# Altium project git.PrjPcb
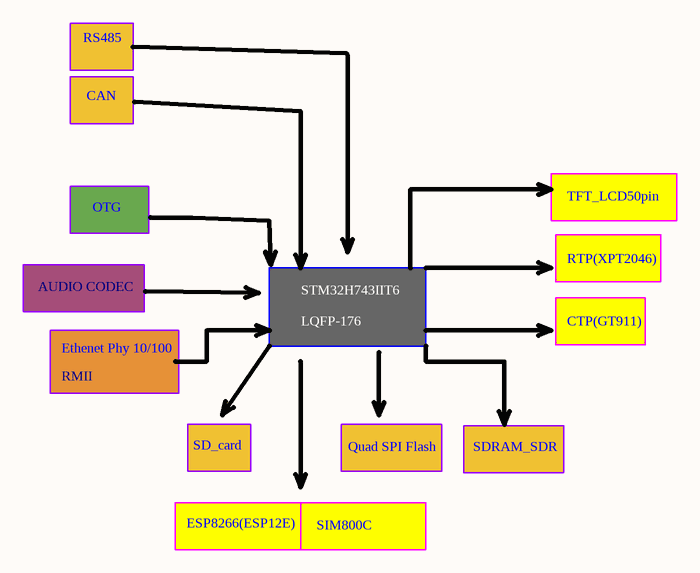
[diagram p0: Block_Diagram.SchDoc]
2 sheets, 15 parts. Net scope: hierarchical (ports join the sheet entries above them; power ports are global).
Board file: MY_HMI.PcbDoc
Sheets:
  Block_Diagram.SchDoc
  TOP.SchDoc

## Sheet Block_Diagram.SchDoc
size A3; SheetNumber: 1; SheetTotal: 22

### Notes on the sheet
- RS485
- CAN
- OTG
- TFT_LCD50pin
- AUDIO CODEC
- STM32H743IIT6
- LQFP-176
- RTP(XPT2046)
- CTP(GT911)
- Ethenet Phy 10/100
- RMII
- SD_card
- Quad SPI Flash
- SDRAM_SDR
- ESP8266(ESP12E)
- SIM800C

## Sheet TOP.SchDoc
size A2; SheetNumber: 3; SheetTotal: 22
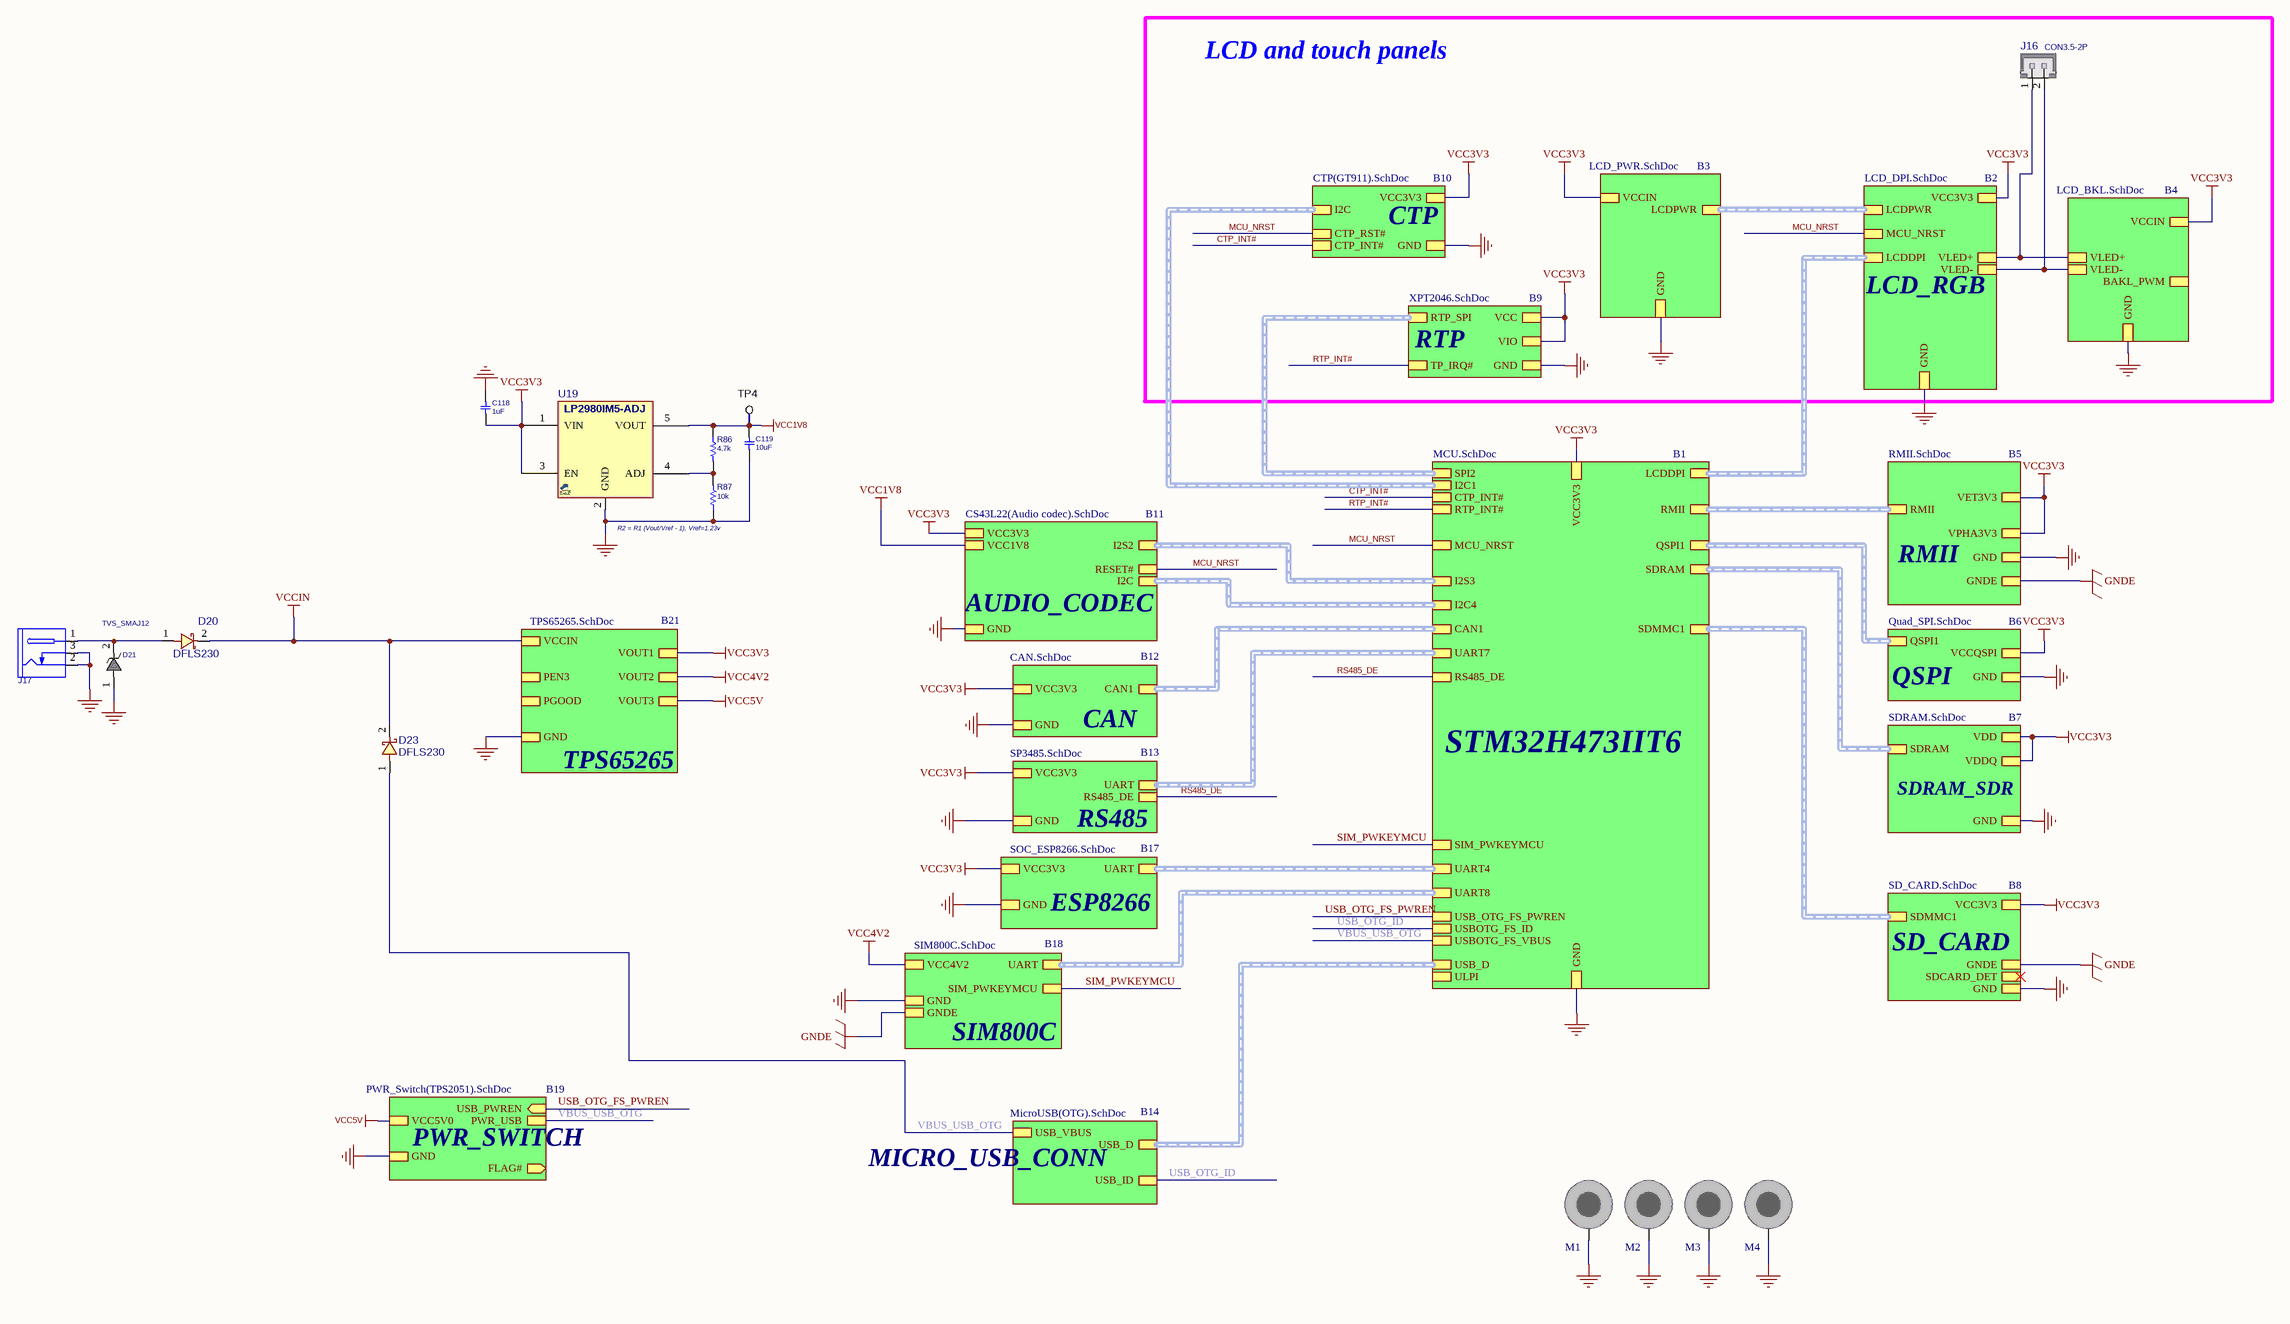
[diagram p1: TOP.SchDoc]

### Parts
C118  1uF  [C0805]
C119  10uF  [C0805]
D20  DFLS230  [D_SOD123W]
D21  TVS_SMAJ12  [D_SMA]
D23  DFLS230  [D_SOD123W]
J16  CON3.5-2P  [ER_CON3P5_2_SMD]
J17  DC_POWER_JACK  [JAC_PWR1]  (value not drawn)
M1  DNP/MH  [SCMH_M3]  (value not drawn)  (no BOM)
M2  DNP/MH  [SCMH_M3]  (value not drawn)  (no BOM)
M3  DNP/MH  [SCMH_M3]  (value not drawn)  (no BOM)
M4  DNP/MH  [SCMH_M3]  (value not drawn)  (no BOM)
R86  4.7k  [R0805]
R87  10k  [R0805]
TP4  TESTPOINT_SMD  [TPSMD_S1]  (value not drawn)  (no BOM)
U19  LP2980IM5-ADJ  [SOT23_5]  (value not drawn)

### Sub-sheets
B1 = MCU.SchDoc (file not in this document): SDRAM (harness SDRAM), LCDDPI (harness LCDDPI), QSPI1 (harness QSPI), RMII (harness RMII), SDMMC1 (harness SDMMC), MCU_NRST, GND, VCC3V3, ULPI (harness ULPI), I2C1 (harness I2C), USB_D (harness USB_D), USBOTG_FS_ID, USBOTG_FS_VBUS, I2C4 (harness I2C), CAN1 (harness CAN), SPI2 (harness SPI), UART4 (harness UART), UART8 (harness UART), UART7 (harness UART), RS485_DE, CTP_INT#, RTP_INT#, I2S3 (harness I2S(Half duplex master)), SIM_PWKEYMCU, USB_OTG_FS_PWREN
B2 = LCD_DPI.SchDoc (file not in this document): LCDDPI (harness LCDDPI), MCU_NRST, GND, VCC3V3, VLED-, VLED+, LCDPWR (harness LCDPWR)
B3 = LCD_PWR.SchDoc (file not in this document): GND, LCDPWR (harness LCDPWR), VCCIN
B4 = LCD_BKL.SchDoc (file not in this document): GND, VCCIN, VLED-, VLED+, BAKL_PWM
B5 = RMII.SchDoc (file not in this document): GND, RMII (harness RMII), GNDE, VET3V3, VPHA3V3
B6 = Quad_SPI.SchDoc (file not in this document): GND, VCCQSPI, QSPI1 (harness QSPI)
B7 = SDRAM.SchDoc (file not in this document): GND, SDRAM (harness SDRAM), VDD, VDDQ
B8 = SD_CARD.SchDoc (file not in this document): GND, VCC3V3, GNDE, SDCARD_DET, SDMMC1 (harness SDMMC)
B9 = XPT2046.SchDoc (file not in this document): GND, VCC, VIO, RTP_SPI (harness SPI), TP_IRQ#
B10 = CTP(GT911).SchDoc (file not in this document): GND, I2C (harness I2C), VCC3V3, CTP_RST#, CTP_INT#
B11 = CS43L22(Audio codec).SchDoc (file not in this document): GND, I2C (harness I2C), VCC3V3, I2S2 (harness I2S(Half duplex master)), VCC1V8, RESET#
B12 = CAN.SchDoc (file not in this document): GND, VCC3V3, CAN1 (harness CAN)
B13 = SP3485.SchDoc (file not in this document): GND, VCC3V3, RS485_DE, UART (harness UART)
B14 = MicroUSB(OTG).SchDoc (file not in this document): USB_D (harness USB_D), USB_ID, USB_VBUS
B17 = SOC_ESP8266.SchDoc (file not in this document): GND, VCC3V3, UART (harness UART)
B18 = SIM800C.SchDoc (file not in this document): GND, UART (harness UART), GNDE, SIM_PWKEYMCU, VCC4V2
B19 = PWR_Switch(TPS2051).SchDoc (file not in this document): GND, VCC5V0, USB_PWREN (in), PWR_USB, FLAG# (out)
B21 = TPS65265.SchDoc (file not in this document): GND, VOUT1, VCCIN, PGOOD, PEN3, VOUT2, VOUT3

### Nets
GND: C118.1 C119.1 D21.1 J17.2(SLEEVE) J17.3(INSERTION_DET) M1.1 M2.1 M3.1 M4.1 R87.1 U19.2(GND) ; sheet B1/GND, sheet B2/GND, sheet B3/GND, sheet B4/GND, sheet B5/GND, sheet B6/GND, sheet B7/GND, sheet B8/GND, sheet B9/GND, sheet B10/GND, sheet B11/GND, sheet B12/GND, sheet B13/GND, sheet B17/GND, sheet B18/GND, sheet B21/GND, sheet B19/GND
GNDE: sheet B5/GNDE, sheet B8/GNDE, sheet B18/GNDE
VCC1V8: C119.2 R86.1 TP4.1 U19.5(VOUT) ; sheet B11/VCC1V8
VCC3V3: C118.2 U19.1(VIN) U19.3(EN) ; sheet B1/VCC3V3, sheet B2/VCC3V3, sheet B3/VCCIN, sheet B4/VCCIN, sheet B5/VET3V3, sheet B5/VPHA3V3, sheet B6/VCCQSPI, sheet B7/VDD, sheet B7/VDDQ, sheet B8/VCC3V3, sheet B9/VCC, sheet B9/VIO, sheet B10/VCC3V3, sheet B11/VCC3V3, sheet B12/VCC3V3, sheet B13/VCC3V3, sheet B17/VCC3V3, sheet B21/VOUT1
VCC4V2: sheet B18/VCC4V2, sheet B21/VOUT2
VCC5V: sheet B21/VOUT3, sheet B19/VCC5V0
VCCIN: D20.2 D23.2 ; sheet B21/VCCIN
CTP_INT#: sheet B1/CTP_INT#, sheet B10/CTP_INT#
MCU_NRST: sheet B1/MCU_NRST, sheet B2/MCU_NRST, sheet B10/CTP_RST#, sheet B11/RESET#
RS485_DE: sheet B1/RS485_DE, sheet B13/RS485_DE
RTP_INT#: sheet B1/RTP_INT#, sheet B9/TP_IRQ#
SIM_PWKEYMCU: sheet B1/SIM_PWKEYMCU, sheet B18/SIM_PWKEYMCU
USB_OTG_FS_PWREN: sheet B1/USB_OTG_FS_PWREN, sheet B19/USB_PWREN
USB_OTG_ID: sheet B1/USBOTG_FS_ID, sheet B14/USB_ID
VBUS_USB_OTG: D23.1 ; sheet B1/USBOTG_FS_VBUS, sheet B14/USB_VBUS, sheet B19/PWR_USB
NetD20_1: D20.1 D21.2 J17.1(TIP)
NetJ16_1: J16.1 ; sheet B2/VLED+, sheet B4/VLED+
NetJ16_2: J16.2 ; sheet B2/VLED-, sheet B4/VLED-
NetR86_2: R86.2 R87.2 U19.4(ADJ)

### Buses and harness runs
harness sheet B1/CAN1 = sheet B12/CAN1
harness sheet B1/I2C1 = sheet B10/I2C
harness sheet B1/I2C4 = sheet B11/I2C
harness sheet B1/I2S3 = sheet B11/I2S2
harness sheet B1/LCDDPI = sheet B2/LCDDPI
harness sheet B1/QSPI1 = sheet B6/QSPI1
harness sheet B1/RMII = sheet B5/RMII
harness sheet B1/SDMMC1 = sheet B8/SDMMC1
harness sheet B1/SDRAM = sheet B7/SDRAM
harness sheet B1/SPI2 = sheet B9/RTP_SPI
harness sheet B1/UART4 = sheet B17/UART
harness sheet B1/UART7 = sheet B13/UART
harness sheet B1/UART8 = sheet B18/UART
harness sheet B1/USB_D = sheet B14/USB_D
harness sheet B2/LCDPWR = sheet B3/LCDPWR

### Notes on the sheet
- LCD and touch panels
- CTP
- LCD_RGB
- RTP
- R2 = R1 (Vout/Vref - 1), Vref=1.23v
- RMII
- AUDIO_CODEC
- QSPI
- TPS65265
- CAN
- STM32H473IIT6
- RS485
- SDRAM_SDR
- ESP8266
- SD_CARD
- SIM800C
- PWR_SWITCH
- MICRO_USB_CONN

### Library data of the parts
C118 C119 = CAP_SMD_MLCC_100n50V: CAP, MLCC; PARAM: X5R, 10%; MANF: Murata; DESC: CAP, MLCC, 100nF, 50V, X7R, 10%, 0402C; PARAM2: 25v; ASSEMBLY: ASSEMBLY; PRICE: 10,000:$0.006; MANF_P#: -
  C118: VALUE: 1uF
  C119: VALUE: 10uF
D20 D23 = DIODE_SMD_SCHOTTKY_DFLS230: DIODE, SCHOTTKY, 30V, 2A; MANF: DIODES; MANF_P#: DFLS230LQ-7; DESC: DESCRIPTION; PARAM2: 30Vrrm, 0.375Vf; PARAM: 2A, -40~125oC; ASSEMBLY: ASSEMBLY; PRICE: 0.7$; VALUE: DFLS230
D21 = TVS_SMAJ6.0A: TVS, ESD PROTECT; MANF_P#: SMAJ12CA; PARAM2: 12VRWM; PARAM: 400W, -55~150°C; MANF: -; PRICE: -; VALUE: TVS_SMAJ12
J16 = ER_CON3P5_2_SMD: CONN, lcd backligh, 3.5mm pitch; MANF_P#: ER-CON3.5-2P-SMD; VALUE: CON3.5-2P
J17 = CONN_PWR_JACKR1: CONN, PWR JACK DC, PLUG DIAM 1.0MM RA THD; MANF: CUI STACK; MANF_P#: PJ-031CH, PJ-031C; PARAM: CH 3A, C 2A; VALUE: DC_POWER_JACK
M1-M4 = SCMH_M3: SCREW mouting, M3, 3.0mm diameter and 6.0mm PanHead; ASSEMBLY: DNP; VALUE: DNP/MH
R86 R87 = RES_SMD: RESISTOR, SMD, 20K, 0402; PARAM: 0.063W; DIST#: MOUSER; PARAM2: 1%; MANF: -; ASSEMBLY: ASSEMBLY; PRICE: 100= 0.5$; DESC: RESISTOR, SMD, 20K, 0402; MANF_P#: -
  R86: VALUE: 4.7k
  R87: VALUE: 10k
TP4 = TESTPOINT_SMD: TEST POINT; MANF: MANF; MANF_P#: MANF_P#; VALUE: VALUE
U19 = VREG_LP2980_SOT23: REG, Linear, LDO0.12V, Adj, 50mA, VIN2.5~16V; MANF: Texas Instruments; PARAM2: 2.5~16VIN, 1.23~15VOUT; PARAM: LDO0.12V, 50mA, -40~125°C; MANF_P#: LP2980IM5-ADJ; PRICE: 1.3$; VALUE: LP2980IM5-ADJ